# EAGLE schematic HTVC8038_Display_v12 (EAGLE 7.4.0)
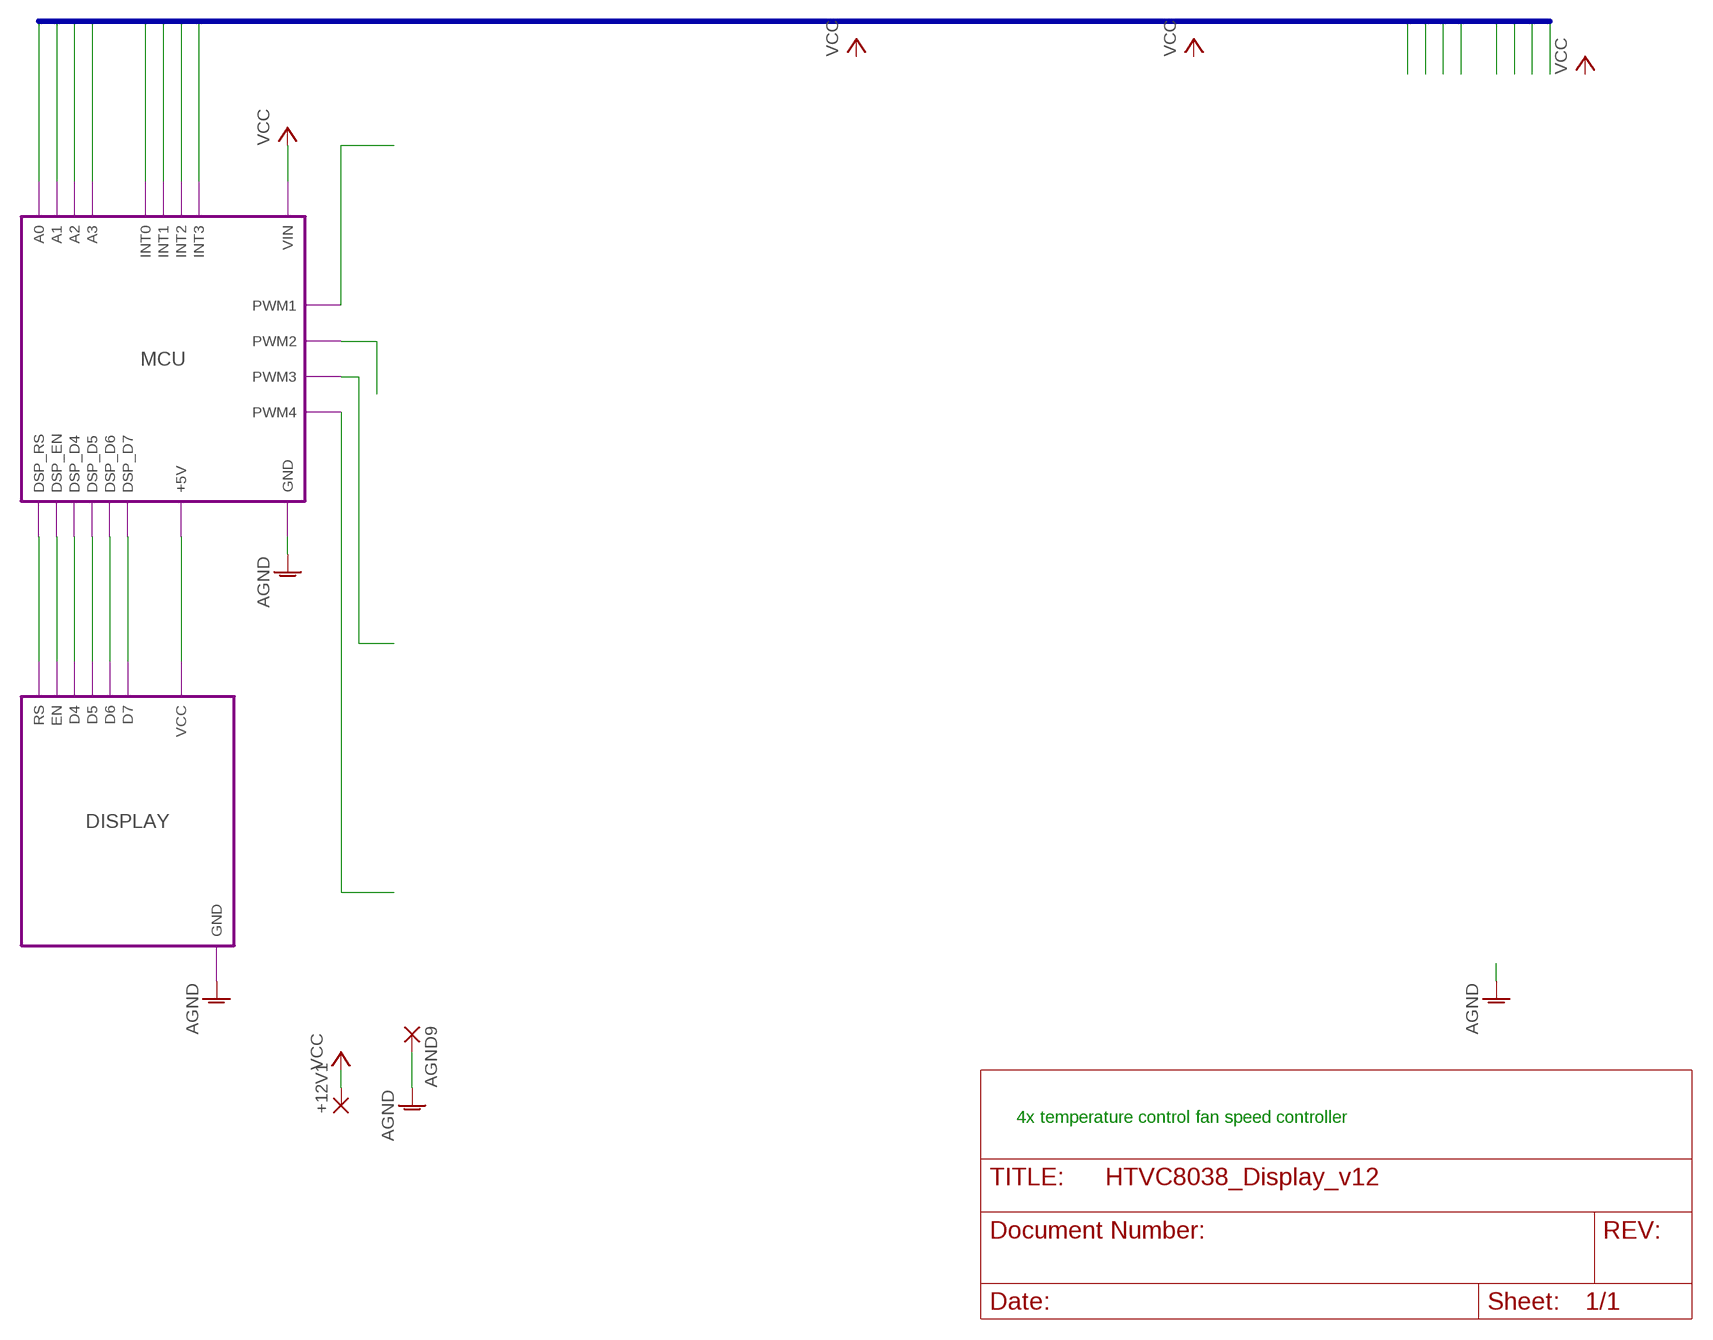
[diagram p0: schematic, sheet 1]

## Parts
+12V1  3,17/1,3  [3,17/1,3]
AGND9  3,17/1,3  [3,17/1,3]

## Module instances
MCU = MCU
DISPLAY = DISPLAY_BOARD

## Nets
+5V [+5V]: port MCU.+5V DISPLAY.VCC
A0: port MCU.A0
A1: port MCU.A1
A2: port MCU.A2
A3: port MCU.A3
AGND [AGND]: AGND9.1(P) ; port DISPLAY.GND MCU.GND
N$1: port MCU.DSP_RS DISPLAY.RS
N$2: port MCU.DSP_EN DISPLAY.EN
N$3: port MCU.DSP_D4 DISPLAY.D4
N$4: port MCU.DSP_D5 DISPLAY.D5
N$5: port MCU.DSP_D6 DISPLAY.D6
N$6: port MCU.DSP_D7 DISPLAY.D7
N$21: port MCU.PWM1
N$22: port MCU.PWM2
N$23: port MCU.PWM3
N$37: port MCU.PWM4
TACH0: port MCU.INT0
TACH1: port MCU.INT1
TACH2: port MCU.INT2
TACH3: port MCU.INT3
VCC [VCC]: +12V1.1(P) ; port MCU.VIN

## Buses
A[0..3],TACH[0..3]

## Notes on the sheet
- 4x temperature control fan speed controller

## Library data of the parts
+12V1 AGND9 = wirepad:3,17/1,3: THROUGH-HOLE PAD

## Module DISPLAY_BOARD
Ports: VCC(pwr) GND(pwr) RS(io) EN(io) D4(io) D5(io) D6(io) D7(io)
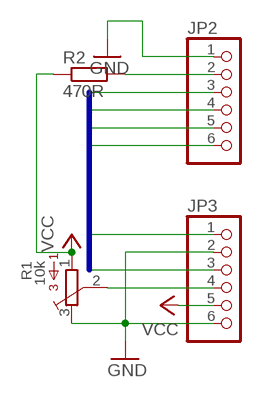
[diagram p1: schematic, module DISPLAY_BOARD, sheet 1]

### Parts
JP2  PINHD-1X6  [1X06]
JP3  PINHD-1X6  [1X06]
R1  10k  3362P  [3362P]
R2  470R  R-EU_0204/7  [0204/7]

### Nets
D4: JP2.6
D5: JP2.5
D6: JP2.4
D7: JP2.3
EN: JP3.1
GND: JP2.1 JP3.2 JP3.6 R1.3
N$1: JP3.4 R1.2
N$2: JP2.2 R2.2
RS: JP3.3
VCC: JP3.5 R1.1 R2.1

### Buses
D[4..7],BACKLIGHT,RS,EN

### Library data of the parts
JP2 JP3 = pinhead:PINHD-1X6: PIN HEADER
R1 = nervus:3362: 3362 Series 1/4" Square Trimmer
R2 = rcl:R-EU_: RESISTOR, European symbol

## Module CONNECTORS_BOARD
Ports: FAN1(io) FAN2(io) FAN3(io) FAN4(io) GND(io) TACH1(io) TACH2(io) TACH3(io) TACH4(io) T1(io) T2(io) T3(io) T4(io) VCC(pwr)
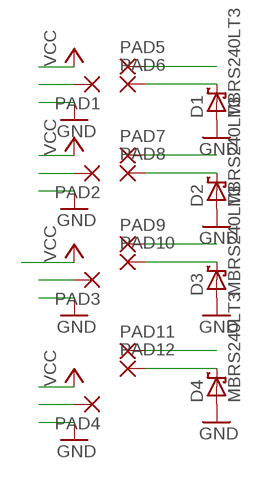
[diagram p2: schematic, module CONNECTORS_BOARD, sheet 1]

### Parts
D1  MBRS240LT3  [SMB-403A]
D2  MBRS240LT3  [SMB-403A]
D3  MBRS240LT3  [SMB-403A]
D4  MBRS240LT3  [SMB-403A]
PAD1  2,15/1,0  [2,15/1,0]
PAD2  2,15/1,0  [2,15/1,0]
PAD3  2,15/1,0  [2,15/1,0]
PAD4  2,15/1,0  [2,15/1,0]
PAD5  2,15/1,0  [2,15/1,0]
PAD6  2,15/1,0  [2,15/1,0]
PAD7  2,15/1,0  [2,15/1,0]
PAD8  2,15/1,0  [2,15/1,0]
PAD9  2,15/1,0  [2,15/1,0]
PAD10  2,15/1,0  [2,15/1,0]
PAD11  2,15/1,0  [2,15/1,0]
PAD12  2,15/1,0  [2,15/1,0]

### Nets
FAN1 [VCC]: D1.C PAD6.1(P)
FAN2 [VCC]: D2.C PAD8.1(P)
FAN3 [VCC]: D3.C PAD10.1(P)
FAN4 [VCC]: D4.C PAD12.1(P)
GND: D1.A D2.A D3.A D4.A
T1: PAD1.1(P)
T2: PAD2.1(P)
T3: PAD3.1(P)
T4: PAD4.1(P)
TACH1: PAD5.1(P)
TACH2: PAD7.1(P)
TACH3: PAD9.1(P)
TACH4: PAD11.1(P)

### Library data of the parts
D1-D4 = nervus:MBRS240LT3: Schottky Power Rectifier Source: http://www.onsemi.com/pub/Collateral/MBRS240LT3-D.PDF
PAD1-PAD12 = wirepad:2,15/1,0: THROUGH-HOLE PAD

## Module MCU
Ports: PWM1(out) PWM2(out) PWM3(out) PWM4(out) +5V(pwr) VIN(pwr) DSP_RS(io) DSP_EN(io) DSP_D4(io) DSP_D5(io) DSP_D6(io) DSP_D7(io) GND(pwr) A0(io) A1(io) A2(io) A3(io) INT0(io) INT1(io) INT2(io) INT3(io)
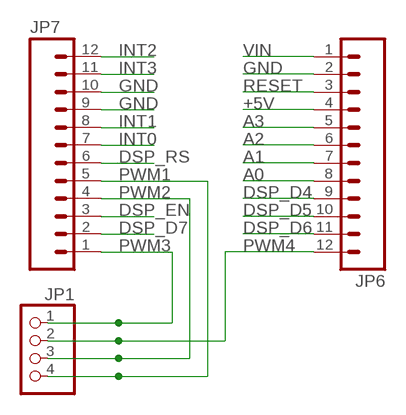
[diagram p3: schematic, module MCU, sheet 1]

### Parts
JP1  PINHD-1X4  [1X04]
JP6  M12PTH  [1X12]
JP7  M12PTH  [1X12]

### Nets
+5V: JP6.4
A0: JP6.8
A1: JP6.7
A2: JP6.6
A3: JP6.5
DSP_D4: JP6.9
DSP_D5: JP6.10
DSP_D6: JP6.11
DSP_D7: JP7.2
DSP_EN: JP7.3
DSP_RS: JP7.6
GND: JP6.2 JP7.9 JP7.10
INT0: JP7.7
INT1: JP7.8
INT2: JP7.12
INT3: JP7.11
PWM1: JP1.4 JP7.5
PWM2: JP1.3 JP7.4
PWM3: JP1.1 JP7.1
PWM4: JP1.2 JP6.12
RESET: JP6.3
VIN [VCC]: JP6.1

### Library data of the parts
JP1 = pinhead:PINHD-1X4: PIN HEADER
JP6 JP7 = SparkFun:M12: Header 12 Standard 12-pin 0.1" header. Use with straight break away headers (SKU : PRT-00116), right angle break away headers (PRT-00553), swiss pins (PRT-00743), machine pins (PRT-00117), and female headers (PRT-00115).

## Net classes
0 default: width 0.406 mm, clearance 0.203 mm
1 VCC: width 0.406 mm, clearance 0.203 mm
2 AGND: width 0.406 mm, clearance 0.203 mm
3 +5V: width 0.406 mm, clearance 0.203 mm